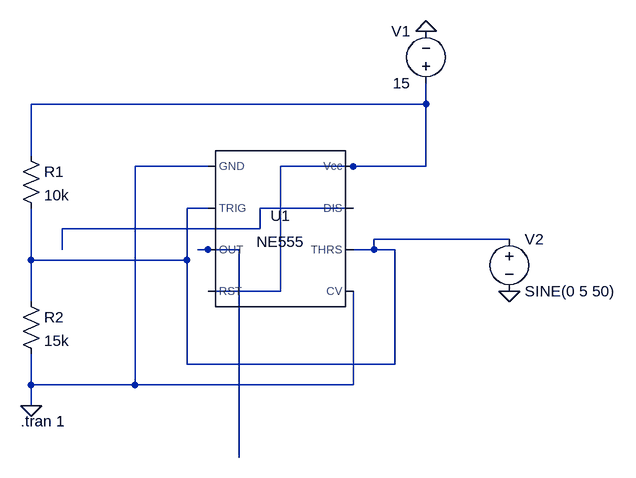
[diagram p0: schematic scmitt 555.asc]
scmitt 555.asc, the LTspice schematic file:
Version 4.1
SHEET 1 880 680
WIRE 416 -32 416 -64
WIRE 416 -32 -192 -32
WIRE -192 48 -192 -32
WIRE 80 64 -32 64
WIRE 304 64 192 64
WIRE 416 64 416 -32
WIRE 416 64 304 64
WIRE 80 128 48 128
WIRE 304 128 160 128
WIRE 160 160 160 128
WIRE 160 160 -144 160
WIRE 544 176 336 176
WIRE -144 192 -144 160
WIRE 80 192 64 192
WIRE 128 192 80 192
WIRE 336 192 336 176
WIRE 336 192 304 192
WIRE 368 192 336 192
WIRE -192 208 -192 128
WIRE 48 208 48 128
WIRE 48 208 -192 208
WIRE 192 256 192 64
WIRE 192 256 80 256
WIRE -192 272 -192 208
WIRE 48 368 48 208
WIRE 368 368 368 192
WIRE 368 368 48 368
WIRE -192 400 -192 352
WIRE -32 400 -32 64
WIRE -32 400 -192 400
WIRE 304 400 304 256
WIRE 304 400 -32 400
WIRE -192 432 -192 400
WIRE 128 512 128 192
FLAG 416 -144 0
FLAG -192 432 0
FLAG 544 256 0
DATAFLAG 128 432 ""
SYMBOL Misc\\NE555 192 160 R0
SYMATTR InstName U1
SYMBOL voltage 416 -48 R180
WINDOW 0 24 96 Left 2
WINDOW 3 24 16 Left 2
WINDOW 123 0 0 Left 0
WINDOW 39 0 0 Left 0
SYMATTR InstName V1
SYMATTR Value 15
SYMBOL res -208 32 R0
SYMATTR InstName R1
SYMATTR Value 10k
SYMBOL res -208 256 R0
SYMATTR InstName R2
SYMATTR Value 15k
SYMBOL voltage 544 160 R0
WINDOW 123 0 0 Left 0
WINDOW 39 0 0 Left 0
SYMATTR InstName V2
SYMATTR Value SINE(0 5 50)
TEXT -208 456 Left 2 !.tran 1

The netlist it stands for:
* scmitt 555.asc
X§U1 0 N002 N004 N001 0 N002 N003 N001 NE555  ; pins GND TRIG OUT RST CV THRS DIS Vcc
V1 N001 0 15
R1 N001 N002 10k
R2 N002 0 15k
V2 N002 0 SINE(0 5 50)
.tran 1
.lib NE555.sub
.backanno
.end